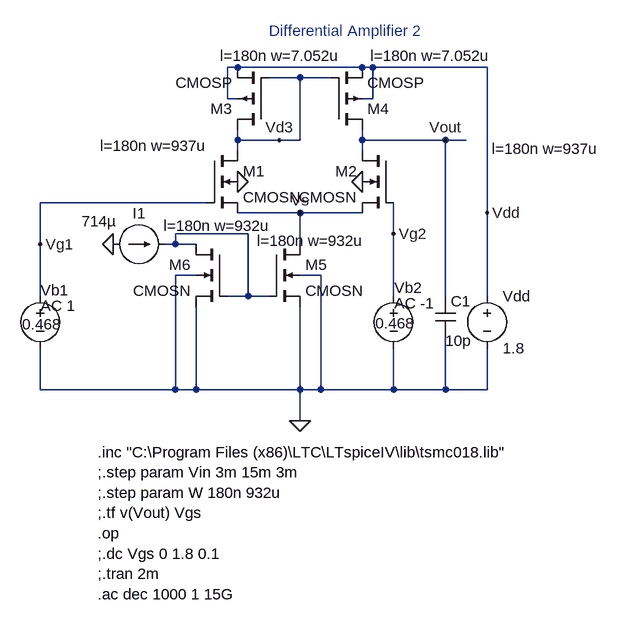
[diagram p0: schematic differential1.asc]
differential1.asc, the LTspice schematic file:
Version 4
SHEET 1 880 888
WIRE 48 64 32 64
WIRE 240 64 48 64
WIRE 256 64 240 64
WIRE 432 64 256 64
WIRE 144 80 96 80
WIRE 192 80 144 80
WIRE 32 112 32 64
WIRE 48 112 32 112
WIRE 256 112 256 64
WIRE 256 112 240 112
WIRE 48 176 48 160
WIRE 112 176 48 176
WIRE 144 176 144 80
WIRE 144 176 112 176
WIRE 240 176 240 160
WIRE 368 176 240 176
WIRE 400 176 368 176
WIRE 48 192 48 176
WIRE 240 192 240 176
WIRE 0 272 -256 272
WIRE 144 288 48 288
WIRE 240 288 144 288
WIRE 432 288 432 64
WIRE 64 320 -48 320
WIRE 288 320 288 272
WIRE -256 336 -256 272
WIRE -48 336 -48 320
WIRE -48 336 -64 336
WIRE -16 336 -48 336
WIRE 144 336 144 288
WIRE -16 384 -48 384
WIRE 176 384 144 384
WIRE -256 416 -256 336
WIRE 64 416 64 320
WIRE 64 416 32 416
WIRE 96 416 64 416
WIRE 288 416 288 320
WIRE 368 416 368 176
WIRE 432 416 432 288
WIRE -256 560 -256 496
WIRE -48 560 -48 384
WIRE -48 560 -256 560
WIRE -16 560 -16 432
WIRE -16 560 -48 560
WIRE 144 560 144 432
WIRE 144 560 -16 560
WIRE 176 560 176 384
WIRE 176 560 144 560
WIRE 288 560 288 496
WIRE 288 560 176 560
WIRE 368 560 368 480
WIRE 368 560 288 560
WIRE 432 560 432 496
WIRE 432 560 368 560
WIRE 144 608 144 560
FLAG 48 240 0
FLAG 240 240 0
FLAG 144 608 0
FLAG 368 176 Vout
FLAG 112 176 Vd3
FLAG 288 320 Vg2
FLAG -256 336 Vg1
FLAG 144 288 Vs
FLAG -144 336 0
FLAG 432 288 Vdd
SYMBOL cmosn 0 192 R0
WINDOW 123 -164 -7 Left 2
SYMATTR Value2 l=180n w=937u
SYMATTR InstName M1
SYMBOL cmosn 288 192 M0
WINDOW 123 -317 -3 Left 2
SYMATTR Value2 l=180n w=937u
SYMATTR InstName M2
SYMBOL cmosp 96 160 R180
WINDOW 123 -111 114 Left 2
SYMATTR Value2 l=180n w=7.052u
SYMATTR InstName M3
SYMBOL cmosp 192 160 M180
WINDOW 123 60 114 Left 2
SYMATTR Value2 l=180n w=7.052u
SYMATTR InstName M4
SYMBOL cmosn 96 336 R0
WINDOW 123 -18 -5 Left 2
SYMATTR Value2 l=180n w=932u
SYMATTR InstName M5
SYMBOL voltage 432 400 R0
WINDOW 123 0 0 Left 2
WINDOW 39 0 0 Left 2
SYMATTR InstName Vdd
SYMATTR Value 1.8
SYMBOL voltage -256 400 R0
WINDOW 3 -28 59 Left 2
WINDOW 0 1 7 Left 2
WINDOW 123 1 31 Left 2
WINDOW 39 0 0 Left 2
SYMATTR Value 0.468
SYMATTR InstName Vb1
SYMATTR Value2 AC 1
SYMBOL voltage 288 400 R0
WINDOW 3 -28 58 Left 2
WINDOW 0 1 3 Left 2
WINDOW 123 1 27 Left 2
WINDOW 39 0 0 Left 2
SYMATTR Value 0.468
SYMATTR InstName Vb2
SYMATTR Value2 AC -1
SYMBOL cmosn 32 336 M0
WINDOW 123 -68 -28 Left 2
SYMATTR Value2 l=180n w=932u
SYMATTR InstName M6
SYMBOL current -144 336 R270
WINDOW 0 32 40 VTop 2
WINDOW 3 51 -21 VBottom 2
WINDOW 123 0 0 Left 2
WINDOW 39 0 0 Left 2
SYMATTR InstName I1
SYMATTR Value 714µ
SYMBOL cap 352 416 R0
WINDOW 3 16 69 Left 2
SYMATTR Value 10p
SYMATTR InstName C1
TEXT 96 8 Left 2 ;Differential Amplifier 2
TEXT -168 656 Left 2 !.inc "C:\\Program Files (x86)\\LTC\\LTspiceIV\\lib\\tsmc018.lib"\n;.step param Vin 3m 15m 3m\n;.step param W 180n 932u\n;.tf v(Vout) Vgs\n.op\n;.dc Vgs 0 1.8 0.1\n;.tran 2m\n.ac dec 1000 1 15G

The netlist it stands for:
* differential1.asc
M1 Vd3 Vg1 Vs 0 CMOSN l=180n w=937u
M2 Vout Vg2 Vs 0 CMOSN l=180n w=937u
M3 Vd3 Vd3 Vdd Vdd CMOSP l=180n w=7.052u
M4 Vout Vd3 Vdd Vdd CMOSP l=180n w=7.052u
M5 Vs N001 0 0 CMOSN l=180n w=932u
Vdd Vdd 0 1.8
Vb1 Vg1 0 0.468 AC 1
Vb2 Vg2 0 0.468 AC -1
M6 N001 N001 0 0 CMOSN l=180n w=932u
I1 0 N001 714µ
C1 Vout 0 10p
.model NMOS NMOS
.model PMOS PMOS
.lib standard.mos
* Differential Amplifier 2
.inc "C:\Program Files (x86)\LTC\LTspiceIV\lib\tsmc018.lib"
;.step param Vin 3m 15m 3m
;.step param W 180n 932u
;.tf v(Vout) Vgs
.op
;.dc Vgs 0 1.8 0.1
;.tran 2m
.ac dec 1000 1 15G
.backanno
.end